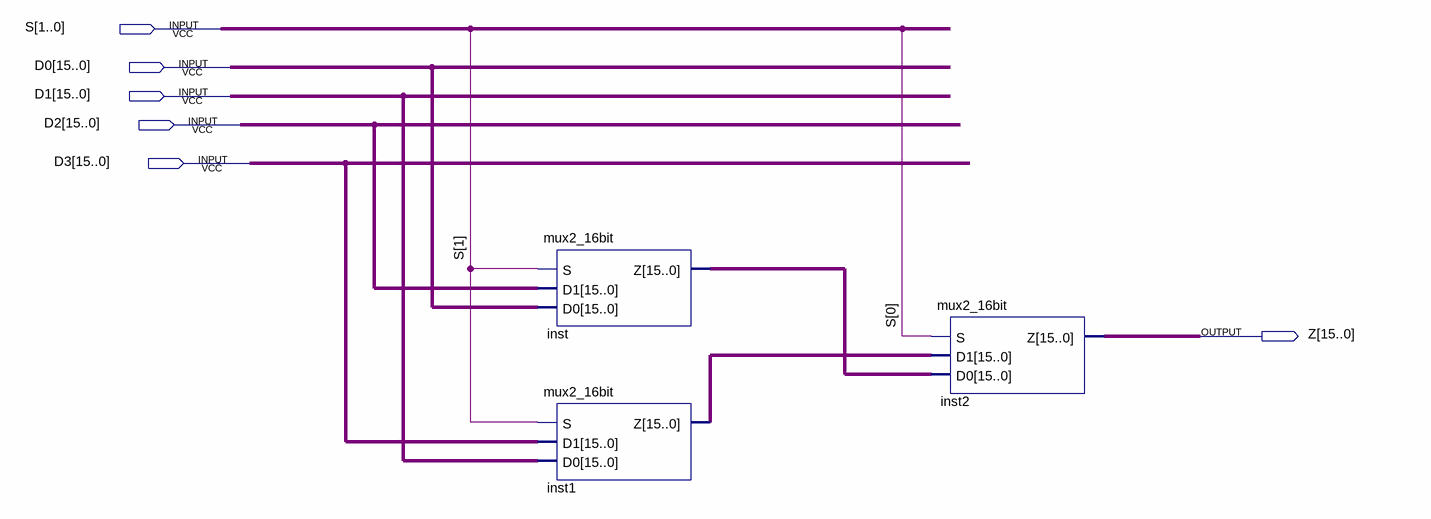
[diagram p0: schematic sheet]
// Quartus schematic mux4_16bit.bdf as structural Verilog: 3 symbols, 6 pins
module mux4_16bit (
  input  [1:0] S,
  input  [15:0] D0,
  input  [15:0] D1,
  input  [15:0] D2,
  input  [15:0] D3,
  output [15:0] Z
);

  wire [15:0] inst1_z, inst_z;

  mux2_16bit inst (.S(S[1]), .D1(D2), .D0(D0), .Z(inst_z));
  mux2_16bit inst1 (.S(S[1]), .D1(D3), .D0(D1), .Z(inst1_z));
  mux2_16bit inst2 (.S(S[0]), .D1(inst1_z), .D0(inst_z), .Z(Z));
endmodule
